# Altium schematic sheet SH3 - USB.SchDoc: USB
size B; CheckedBy: Lance Bantoto; Engineer: Christopher Arjune; Organization: UW Robotics; Address1: 200 University Avenue; Address2: Waterloo; Address3: Ontario; Address4: Canada N2L 3G6; Revision: 1; SheetNumber: 3; SheetTotal: 6
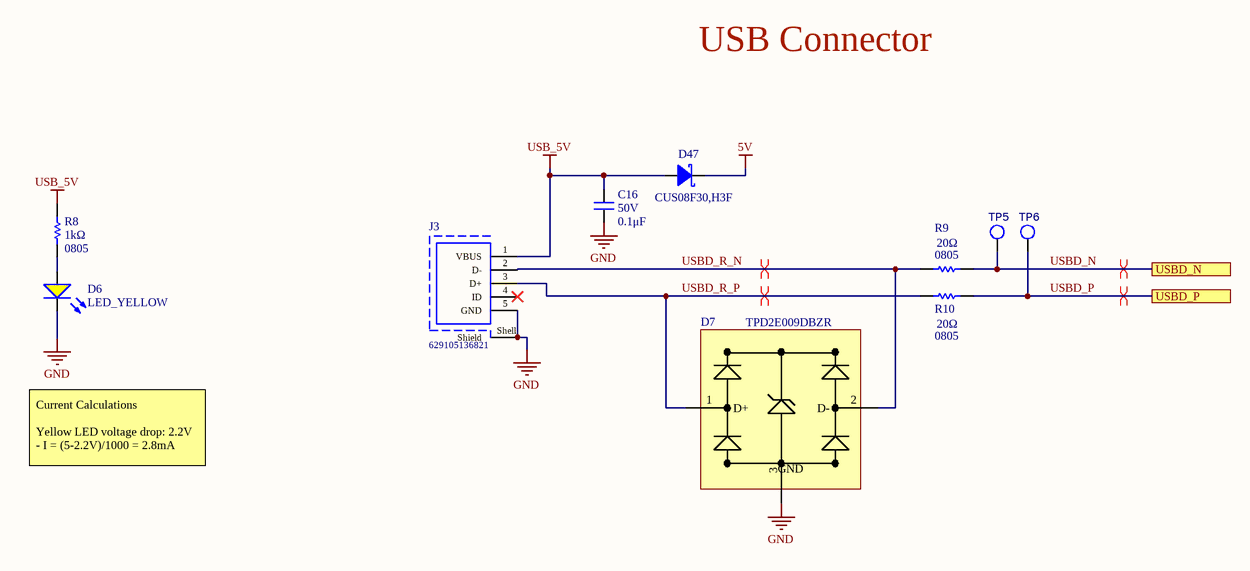
[diagram p0: SH3 - USB.SchDoc]

## Parts
C16  value 0.1μF  Voltage Rating: 50V  [CAP2012]  (hidden comment: CAP_0.1uF_50V_0805)
D6  LED_YELLOW  [LED_0805_YELLOW]
D7  Manufacturer Part Number 1: TPD2E009DBZR  [SOT23-3]  (hidden comment: TVS_DIODE_USB_5.5V)
D47  Manufacturer Part Number 1: CUS08F30,H3F  [SOD-323_UNIDIR]  (hidden comment: DIO_SCHOTTKY_30V_800mA)
J3  629105136821  [629105136821]
R8  Package/Footprint: 0805  Parameter 1: 1kΩ  [RESC0805]  (hidden comment: RES_1kΩ_0805_1%)
R9  value 20Ω  Package/Footprint: 0805  [RESC0805]  (hidden comment: RES_20Ω_0805_1%)
R10  value 20Ω  Package/Footprint: 0805  [RESC0805]  (hidden comment: RES_20Ω_0805_1%)
TP5  TESTPOINT_LOOP  [TESTPOINT_LOOP]  (value not drawn)
TP6  TESTPOINT_LOOP  [TESTPOINT_LOOP]  (value not drawn)

## Ports
USBD_N, USBD_P

## Nets
5V: D47.2(Cathode)
GND: C16.2 D6.2(K) D7.3(GND) J3.5(GND) J3.Shell(Shield)
USB_5V: C16.1 D47.1(Anode) J3.1(VBUS) R8.2
USBD_N: R9.2 TP5.1 ; port USBD_N
USBD_P: R10.2 TP6.1 ; port USBD_P
USBD_R_N: D7.2(D-) J3.2(D-) R9.1
USBD_R_P: D7.1(D+) J3.3(D+) R10.1
NetD6_1: D6.1(A) R8.1

Not connected (* = marked no-connect by the designer): J3 4(ID)*

## Layout directives
differential pair: USBD_N, USBD_P, USBD_R_N, USBD_R_P

## Notes on the sheet
- USB Connector
- Current Calculations
  Yellow LED voltage drop: 2.2V
  - I = (5-2.2V)/1000 = 2.8mA
- Title:
- Project:
- Date:
- Rev:
- Checker:
- Engineer:
- Sheet:
- of

## Library data of the parts
C16 = CAP_0.1uF_50V_0805: CAP CER 0.1UF 50V X7R 0805; Manufacturer 1: Murata Electronics; Manufacturer Part Number 1: GCM21BR71H104KA37K; Package/Footprint: 0805; Supplier 1: Digi-Key; Supplier Part Number 1: 490-8049-1-ND; Mounting Type: SMD; Dielectric: X7R; LCSC Part #: C49678
D6 = LED_YELLOW: LED YELLOW DIFFUSED 0805 SMD; Manufacturer 1: OSRAM; Manufacturer Part Number 1: LY R976-PS-36; Forward Voltage Drop: 2.2V; Package: 0805 (2012 Metric); Supplier Part Number 1: 475-2560-1-ND; Supplier 1: Digi-Key
D7 = TVS_DIODE_USB_5.5V: TVS DIODE 5.5V 8V SOT23-3; Manufacturer 1: Texas Instruments; Package/Footprint: SOT-23-3; Supplier 1: Digi-Key; Supplier Part Number 1: 296-24657-1-ND; Verified: No; Mounting Type: SMD
D47 = DIO_SCHOTTKY_30V_800mA: DIODE SCHOTTKY 30V 800MA USC; Manufacturer 1: Toshiba Semiconductor and Storage; Vf (Max): 220mV; Supplier 1: Digi-Key; Supplier Part Number 1: CUS08F30H3FCT-ND; Vr (Max): 30V; Io: 800mA; Mounting Type: SMD
J3 = CMP-1502-03253-1: Micro USB 2.0 Type B Receptacle WR-COM, Horizontal, SMT, with Pads and Pegs; Manufacturer: Wurth Elektronik; Contact Resistance: 30mOhm; Rated Current: 1A; Working Voltage: 30VAC; Datasheet URL: https://katalog.we-online.de/em/datasheet/629105136821.pdf; Mounting Technology: SMT; Publisher: WurthElektronik; Package Reference: 629105136821; Orientation: Horizontal; Packaging: TapeandReel; Part Number: 629105136821; Manufacturer URL: http://www.we-online.de; Connector Type: MicroUSB2.0TypeB; Gender: Receptacle; Operating Temperature: -40to105degC
R8 = RES_1kΩ_0805_1%: RES 1K OHM 1% 1/8W 0805; Manufacturer 1: Yageo; Manufacturer Part Number 1: RC0805FR-071KL; Supplier 1: Digi-Key; Supplier Part Number 1: 311-1.00KCRCT-ND; Mounting Type: SMD; LCSC Part #: C17513
R9 R10 = RES_20Ω_0805_1%: RES 20 OHM 1% 1/8W 0805; Manufacturer Part Number 1: RC0805FR-0720RL; Manufacturer 1: Yageo; Supplier 1: Digi-Key; Supplier Part Number 1: 311-20.0CRCT-ND; Mounting Type: SMD; LCSC Part #: C17581
TP5 TP6 = TESTPOINT_LOOP: TESTPOINT THRUHOLE; Manufacturer Part Number 1: 5002; Manufacturer 1: Keystone Electronics; Package/Footprint: TH; Supplier Part Number 1: 36-5002-ND; Supplier 1: Digi-Key; Mounting Type: TH